# Altium project Fri3D_Bot_2018_00.PrjPcb
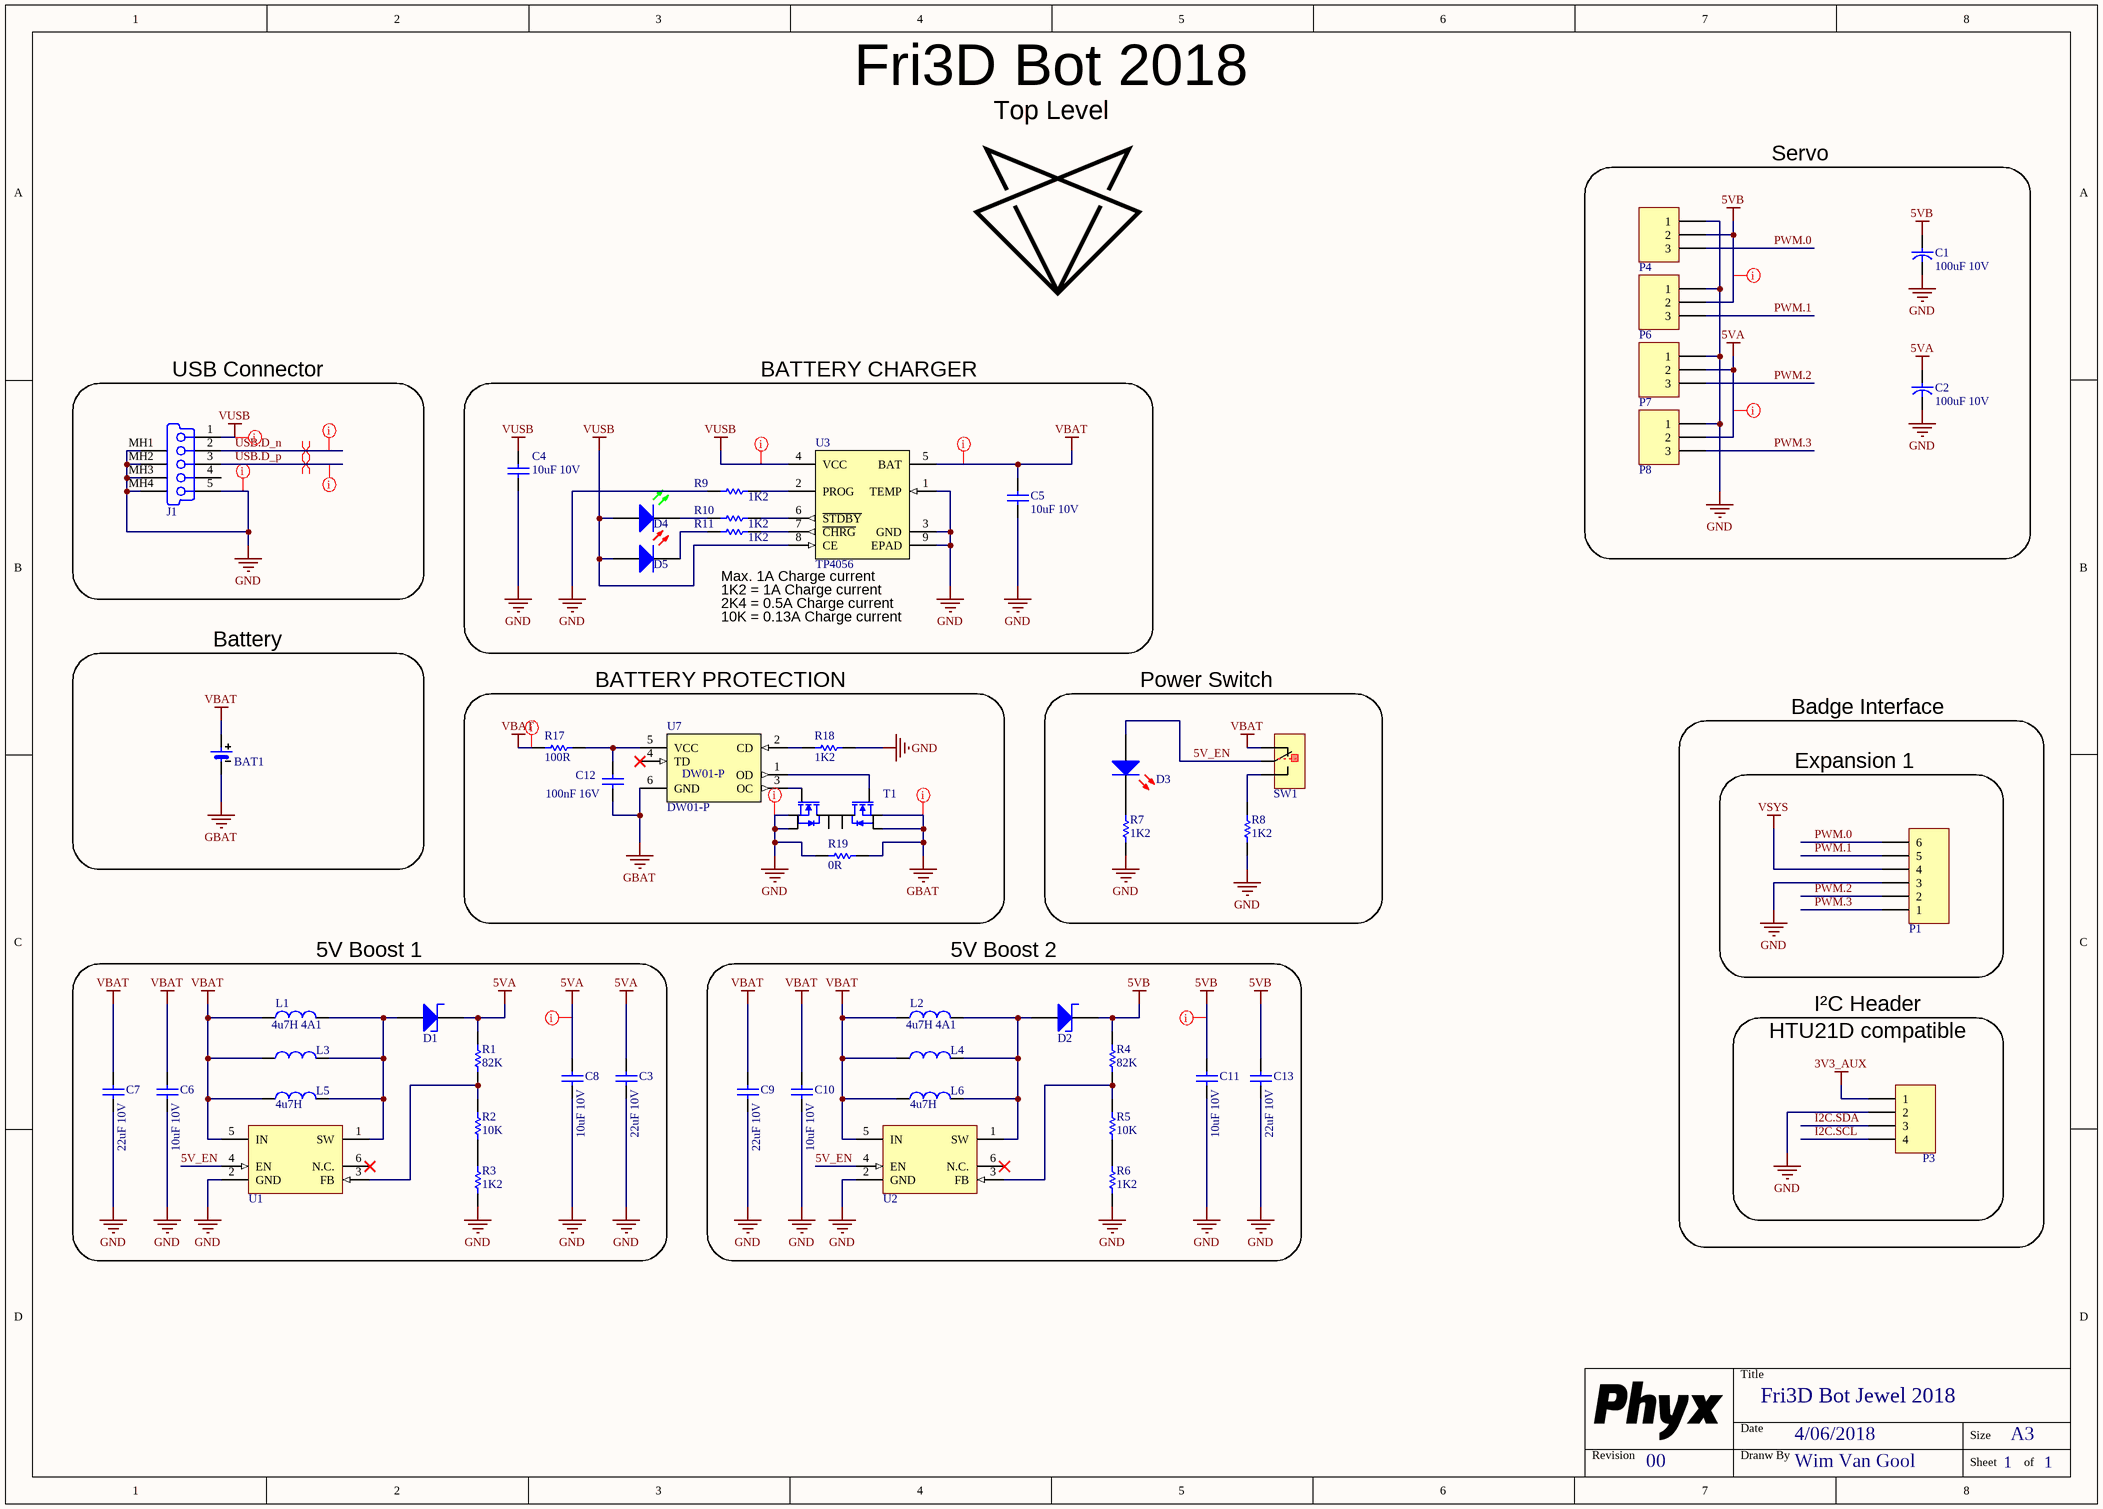
[diagram p0: Fri3D_Bot_2018_00.SchDoc]
PCB_ENGINEER: WimVG; PCB_REV: 00; PCB_TITLE: Fri3D Bot 2018
1 sheet, 52 parts. Net scope: global (net labels, ports and power ports of the same name join across sheets).
Board file: Fri3D_Bot_2018_00.PcbDoc

## Sheet Fri3D_Bot_2018_00.SchDoc: Fri3D Bot Jewel 2018
size A3; Date: 4/06/2018; DrawnBy: Wim Van Gool; DocumentNumber: 1; Revision: 00; SheetNumber: 1; SheetTotal: 1

### Parts
BAT1  18650 Battery holder  [MPD_BH-18650-PC]  (value not drawn)
C1  value 100uF 10V  [C_5x11_2mm]  (hidden comment: CAP_POL)
C2  value 100uF 10V  [C_5x11_2mm]  (hidden comment: CAP_POL)
C3  value 22uF 10V  [C1210_N]  (hidden comment: CAP_CERAMIC)
C4  value 10uF 10V  [C0805_N]  (hidden comment: CAP_CERAMIC)
C5  value 10uF 10V  [C0805_N]  (hidden comment: CAP_CERAMIC)
C6  value 10uF 10V  [C0805_N]  (hidden comment: CAP_CERAMIC)
C7  value 22uF 10V  [C1210_N]  (hidden comment: CAP_CERAMIC)
C8  value 10uF 10V  [C0805_N]  (hidden comment: CAP_CERAMIC)
C9  value 22uF 10V  [C1210_N]  (hidden comment: CAP_CERAMIC)
C10  value 10uF 10V  [C0805_N]  (hidden comment: CAP_CERAMIC)
C11  value 10uF 10V  [C0805_N]  (hidden comment: CAP_CERAMIC)
C12  value 100nF 16V  [C0603_N]
C13  value 22uF 10V  [C1210_N]  (hidden comment: CAP_CERAMIC)
D1  TSS83L45 MWG Schottky ULTRAFAST, 3A, 45V  [TS_SOD128]  (value not drawn)
D2  TSS83L45 MWG Schottky ULTRAFAST, 3A, 45V  [TS_SOD128]  (value not drawn)
D3  Default 0805 Red LED  [LED_0805_RD]  (value not drawn)
D4  Default 0805 Green LED  [LED_0805_GR]  (value not drawn)
D5  Default 0805 Red LED  [LED_0805_RD]  (value not drawn)
J1  Amphenol FCI 10118194-0001LF Micro USB 1.8A TH Lock  [FCI_10118194-0001LF]  (value not drawn)
L1  value 4u7H 4A1  [TAI_NRS8040]  (hidden comment: NRS8040T4R7NJGJ)
L2  value 4u7H 4A1  [TAI_NRS8040]  (hidden comment: NRS8040T4R7NJGJ)
L3  VLC6045T-3R3N  [IND_6045]  (value not drawn)
L4  VLC6045T-3R3N  [IND_6045]  (value not drawn)
L5  value 4u7H  [SNL_SWPA4020]  (hidden comment: SWPA4020S4R7MT)
L6  value 4u7H  [SNL_SWPA4020]  (hidden comment: SWPA4020S4R7MT)
P1  Header 6  [HDR1X6]  (value not drawn)
P3  Header 4  [HDR1X4]  (value not drawn)
P4  Header 3  [HDR1X3]  (value not drawn)
P6  Header 3  [HDR1X3]  (value not drawn)
P7  Header 3  [HDR1X3]  (value not drawn)
P8  Header 3  [HDR1X3]  (value not drawn)
R1  value 82K  [R0603_N]  (hidden comment: RESISTOR)
R2  value 10K  [R0603_N]  (hidden comment: RESISTOR)
R3  value 1K2  [R0603_N]  (hidden comment: RESISTOR)
R4  value 82K  [R0603_N]  (hidden comment: RESISTOR)
R5  value 10K  [R0603_N]  (hidden comment: RESISTOR)
R6  value 1K2  [R0603_N]  (hidden comment: RESISTOR)
R7  value 1K2  [R0603_N]  (hidden comment: RESISTOR)
R8  value 1K2  [R0603_N]  (hidden comment: RESISTOR)
R9  value 1K2  [R0603_N]  (hidden comment: RESISTOR)
R10  value 1K2  [R0603_N]  (hidden comment: RESISTOR)
R11  value 1K2  [R0603_N]  (hidden comment: RESISTOR)
R17  value 100R  [R0603_N]  (hidden comment: RESISTOR)
R18  value 1K2  [R0603_N]  (hidden comment: RESISTOR)
R19  value 0R  [R1206]  (hidden comment: RESISTOR)
SW1  mini Switch 1 pole double throw right angle  [SK-12D07]  (value not drawn)
T1  Dual N-Ch MOSFET Common Drain  [TSSOP_8_65P]  (value not drawn)
U1  High Efficiency 1.2MHz 2A Step Up Converter  SX1308  [SOT23-6]  (value not drawn)
U2  High Efficiency 1.2MHz 2A Step Up Converter  SX1308  [SOT23-6]  (value not drawn)
U3  value TP4056  [SOIC_N_8_TH]  (hidden comment: Single Cell LiIon charger max 1A)
U7  value DW01-P  [SOT23-6]  (hidden comment: DW01-P single cell lithium protection)

### Blocks framed on the sheet
Servo: C1 C2 P4 P6-P8
USB Connector: J1
BATTERY CHARGER: C4 C5 D4 D5 R9-R11 U3
Battery: BAT1
BATTERY PROTECTION: C12 R17-R19 T1 U7
Power Switch: D3 R7 R8 SW1
Expansion 1: P1
5V Boost 1: C3 C6-C8 D1 L1 L3 L5 R1-R3 U1
5V Boost 2: C9-C11 C13 D2 L2 L4 L6 R4-R6 U2

### Nets
3V3_AUX: P3.1
5VA: C2.1 C3.1 C8.1 D1.1(C) P7.2 P8.2 R1.1
5VB: C1.1 C11.1 C13.1 D2.1(C) P4.2 P6.2 R4.1
GBAT: BAT1.2 C12.2 R19.1 T1.2(S1) T1.3(S1) U7.6(GND)
GND: C1.2 C2.2 C3.2 C4.2 C5.2 C6.2 C7.2 C8.2 C9.2 C10.2 C11.2 C13.2 J1.5(GND) J1.MH1(Tab) J1.MH2(Tab) J1.MH3(Tab) J1.MH4(Tab) P1.3 P3.2 P4.1 P6.1 P7.1 P8.1 R3.2 R6.2 R7.2 R8.2 R9.2 R18.2 R19.2 T1.6(S2) T1.7(S2) U1.2(GND) U2.2(GND) U3.1(TEMP) U3.3(GND) U3.9(EPAD)
VBAT: BAT1.1 C5.1 C6.1 C7.1 C9.1 C10.1 L1.1 L2.1 L3.1 L4.1 L5.1 L6.1 R17.1 SW1.1 U1.5(IN) U2.5(IN) U3.5(BAT)
VSYS: P1.4
VUSB: C4.1 D4.1(A) D5.1(A) J1.1(V_BUS_(5V)) U3.4(VCC) U3.8(CE)
5V_EN: D3.1(A) SW1.2 U1.4(EN) U2.4(EN)
I2C.SCL: P3.4
I2C.SDA: P3.3
PWM.0: P1.6 P4.3
PWM.1: P1.5 P6.3
PWM.2: P1.2 P7.3
PWM.3: P1.1 P8.3
USB.D_n: J1.2(D-)
USB.D_p: J1.3(D+)
NetC12_1: C12.1 R17.2 U7.5(VCC)
NetD1_2: D1.2(A) L1.2 L3.2 L5.2 U1.1(SW)
NetD2_2: D2.2(A) L2.2 L4.2 L6.2 U2.1(SW)
NetD3_2: D3.2(K) R7.1
NetD4_2: D4.2(K) R10.1
NetD5_2: D5.2(K) R11.1
NetR1_2: R1.2 R2.1 U1.3(FB)
NetR2_2: R2.2 R3.1
NetR4_2: R4.2 R5.1 U2.3(FB)
NetR5_2: R5.2 R6.1
NetR8_1: R8.1 SW1.3
NetR9_1: R9.1 U3.2(PROG)
NetR10_2: R10.2 U3.6(~{STDBY})
NetR11_2: R11.2 U3.7(~{CHRG})
NetR18_1: R18.1 U7.2(CD)
NetT1_4: T1.4(G1) U7.1(OD)
NetT1_5: T1.5(G2) U7.3(OC)

Not connected (* = marked no-connect by the designer): J1 4(NC); T1 1(D1) 8(D2); U1 6(N.C.)*; U2 6(N.C.)*; U7 4(TD)*

### Layout directives
net class POWER: 5VA, 5VB, GBAT, GND, VBAT, VUSB
net class 90r: USB.D_n, USB.D_p
differential pair: USB.D_n, USB.D_p

### Notes on the sheet
- Fri3D Bot 2018
- Top Level
- Max. 1A Charge current
- 1K2 = 1A Charge current
- 2K4 = 0.5A Charge current
- 10K = 0.13A Charge current
- Badge Interface
- I²C Header
- HTU21D compatible
- Title
- Revision
- Date
- Dranw By
- Size
- A3
- Sheet
- of

### Library data of the parts
BAT1 = 18650 Battery holder BH-18650-PC: =Description; Value: BH-18650-PC; Supplier 1: Digikey
C1 C2 = CAP 100uF 10V 5x11mm: Capacitor electrolyt; Supplier 1: Farnell; Supplier Part Number 1: 1902882
C3 C7 C9 C13 = CAP # 22uF 10V 1210 X5R: Capacitor Ceramic
C4-C6 C8 C10 C11 = CAP # 10uF 10V 0805: Capacitor Ceramic; Supplier 1: Farnell; Supplier Part Number 1: 2320859
C12 = CAP # 100nF 16V 0603: Capacitor Ceramic
D1 D2 = Schottky # TSS83L45MWG 3A 45V: =Description; Value: TSS83L45 MWG; Supplier 1: Digi-key; Supplier Part Number 1: TSS83L45MWGCT-ND
D3 D5 = LED # Red 0805: =Description; Supplier 1: Farnell; Supplier Part Number 1: 2099236
D4 = LED # Green 0805: =Description; Supplier 1: Farnell; Supplier Part Number 1: 2099239
J1 = USB # Micro B TH Amphenol 10118194-0001LF: Value: 10118194-0001LF; Supplier 1: Farnell; Supplier Part Number 1: 2668482; Supplier 2: Digi-key; Supplier Part Number 2: 609-4618-2-ND
L1 L2 = IND # 4u7H 4A1 NRS8040T4R7NJGJ: Supplier 1: Digi-key; Supplier Part Number 1: 587-2978-1-ND
L3 L4 = IND # 3u3H 6x6mm: Value: 3u3H; Supplier 1: Digi-key; Supplier Part Number 1: 445-6536-1-ND
L5 L6 = IND # 4u7H SWPA4020: Supplier 1: China; Supplier Part Number 1: SWPA4020S4R7MT
P1 = Pin Header 2.54mm 6way
P3 = Pin Header 2.54mm 4way
P4 P6-P8 = Pin Header 2.54mm 3way
R1 R4 = RES # 82K 0603
R2 R5 = RES # 10K 0603: Supplier 1: Farnell; Supplier Part Number 1: 2502397
R3 R6-R11 R18 = RES # 1K2 0603
R17 = RES # 100R 0603
R19 = RES # 0R 1206
SW1 = SW 1P2T micro RA SK-12D07: Value: SK-12D07; Supplier 1: AliExpress; Supplier Part Number 1: SK-12D07
T1 = FS8205A Dual N-Ch common Drain for DW01-P: =Description; Value: FS8205A; Supplier 1: AliExpress; Supplier Part Number 1: FS8205A
U1 U2 = PWR # Boost SX1308: =Description; Value: SX1308
U3 = CHG # TP4056 LiIon 1A: =Description; Supplier 1: Aliexpress; Supplier Part Number 1: TP4056
U7 = PWR # DW01-P Lithium protection: =Description; Supplier 1: Aliexpress; Supplier Part Number 1: DW01-P

## Assembly variants
Not Mounted: not fitted C1 C2 C4 J1 L1 L2 L3 L4 R19